# EAGLE schematic Crystal Filter v2 (EAGLE 9.1.2)
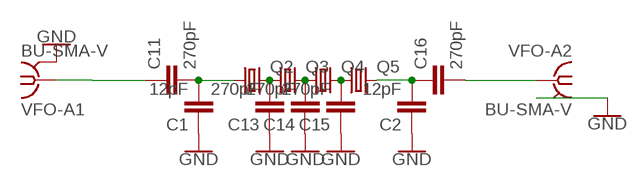
[diagram p0: schematic, sheet 1]

## Parts
C1  12pF  C5/3.5  [C5B3.5]
C2  12pF  C5/3.5  [C5B3.5]
C11  270pF  C5/3.5  [C5B3.5]
C13  270pF  C5/3.5  [C5B3.5]
C14  270pF  C5/3.5  [C5B3.5]
C15  270pF  C5/3.5  [C5B3.5]
C16  270pF  C5/3.5  [C5B3.5]
Q2  CRYTALHC49S  [HC49/S]
Q3  CRYTALHC49S  [HC49/S]
Q4  CRYTALHC49S  [HC49/S]
Q5  CRYTALHC49S  [HC49/S]
VFO-A1  BU-SMA-V  [BU-SMA-V]
VFO-A2  BU-SMA-V  [BU-SMA-V]

## Nets
GND: C1.1 C2.1 C13.1 C14.1 C15.1 VFO-A1.2 VFO-A1.3 VFO-A1.4 VFO-A1.5 VFO-A2.2 VFO-A2.3 VFO-A2.4 VFO-A2.5
N$1: C1.2 C11.2 Q2.1
N$3: C16.2 VFO-A2.1
N$4: C11.1 VFO-A1.1
N$12: C2.2 C16.1 Q5.2
N$17: C13.2 Q2.2 Q3.1
N$18: C14.2 Q3.2 Q4.1
N$19: C15.2 Q4.2 Q5.1

## Library data of the parts
C1 C2 C11 C13-C16 = capacitor-wima:C: CAPACITOR naming: grid - package width
Q2-Q5 = crystal:CRYTAL: CRYSTAL
VFO-A1 VFO-A2 = con-coax:BU-SMA-V: FEMALE SMA CONNECTOR Radiall distributor RS 112-3794; OC_FARNELL: unknown; OC_NEWARK: unknown

## Net classes
0 default: width 0.762 mm, drill 0.762 mm, clearance 0.508 mm